# Altium project 起跑.PrjPCB
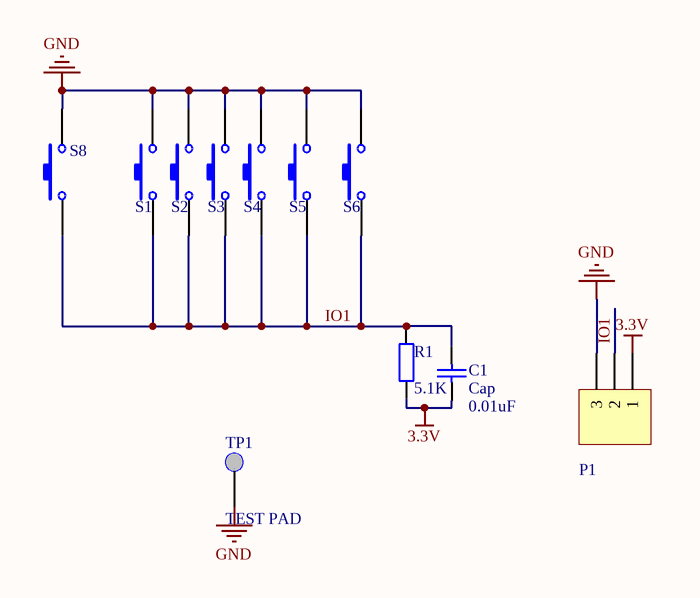
[diagram p0: 起跑.SchDoc]
1 sheet, 11 parts. Net scope: global (net labels, ports and power ports of the same name join across sheets).
Board file: 起跑.PcbDoc

## Sheet 起跑.SchDoc
size A4

### Parts
C1  Cap  value 0.01uF  [C2012]
P1  Header 3  [HDR1X3]  (value not drawn)
R1  value 5.1K  [R2012]  (hidden comment: Res2)
S1  SW-PB  [AXIAL-0.9]  (value not drawn)
S2  SW-PB  [AXIAL-0.9]  (value not drawn)
S3  SW-PB  [AXIAL-0.9]  (value not drawn)
S4  SW-PB  [AXIAL-0.9]  (value not drawn)
S5  SW-PB  [AXIAL-0.9]  (value not drawn)
S6  SW-PB  [AXIAL-0.9]  (value not drawn)
S8  SW-PB  [AXIAL-0.9]  (value not drawn)
TP1  TEST PAD  [PIN]

### Nets
3.3V: C1.1 P1.1 R1.1
GND: P1.3 S1.2 S2.2 S3.2 S4.2 S5.2 S6.2 S8.2 TP1.1
IO1: C1.2 P1.2 R1.2 S1.1 S2.1 S3.1 S4.1 S5.1 S6.1 S8.1

### Library data of the parts
C1 = Cap: Capacitor; Published: 8-Jun-2000; LatestRevisionDate: 17-Jul-2002; LatestRevisionNote: Re-released for DXP Platform.; PackageReference: RAD-0.3; Publisher: Altium Limited
P1 = Header 3: Header, 3-Pin; LatestRevisionDate: 17-Jul-2002; LatestRevisionNote: Re-released for DXP Platform.; Publisher: Altium Limited
R1 = Res2: Resistor; Published: 8-Jun-2000; LatestRevisionDate: 17-Jul-2002; LatestRevisionNote: Re-released for DXP Platform.; PackageReference: AXIAL-0.4; Publisher: Altium Limited
S1-S6 S8 = SW-PB: Switch; Published: 24-Mar-1999; LatestRevisionDate: 17-Jul-2002; LatestRevisionNote: Re-released for DXP Platform.; PackageReference: SPST-2; Publisher: Altium Limited